# EAGLE design cdrbot (EAGLE 6.2)
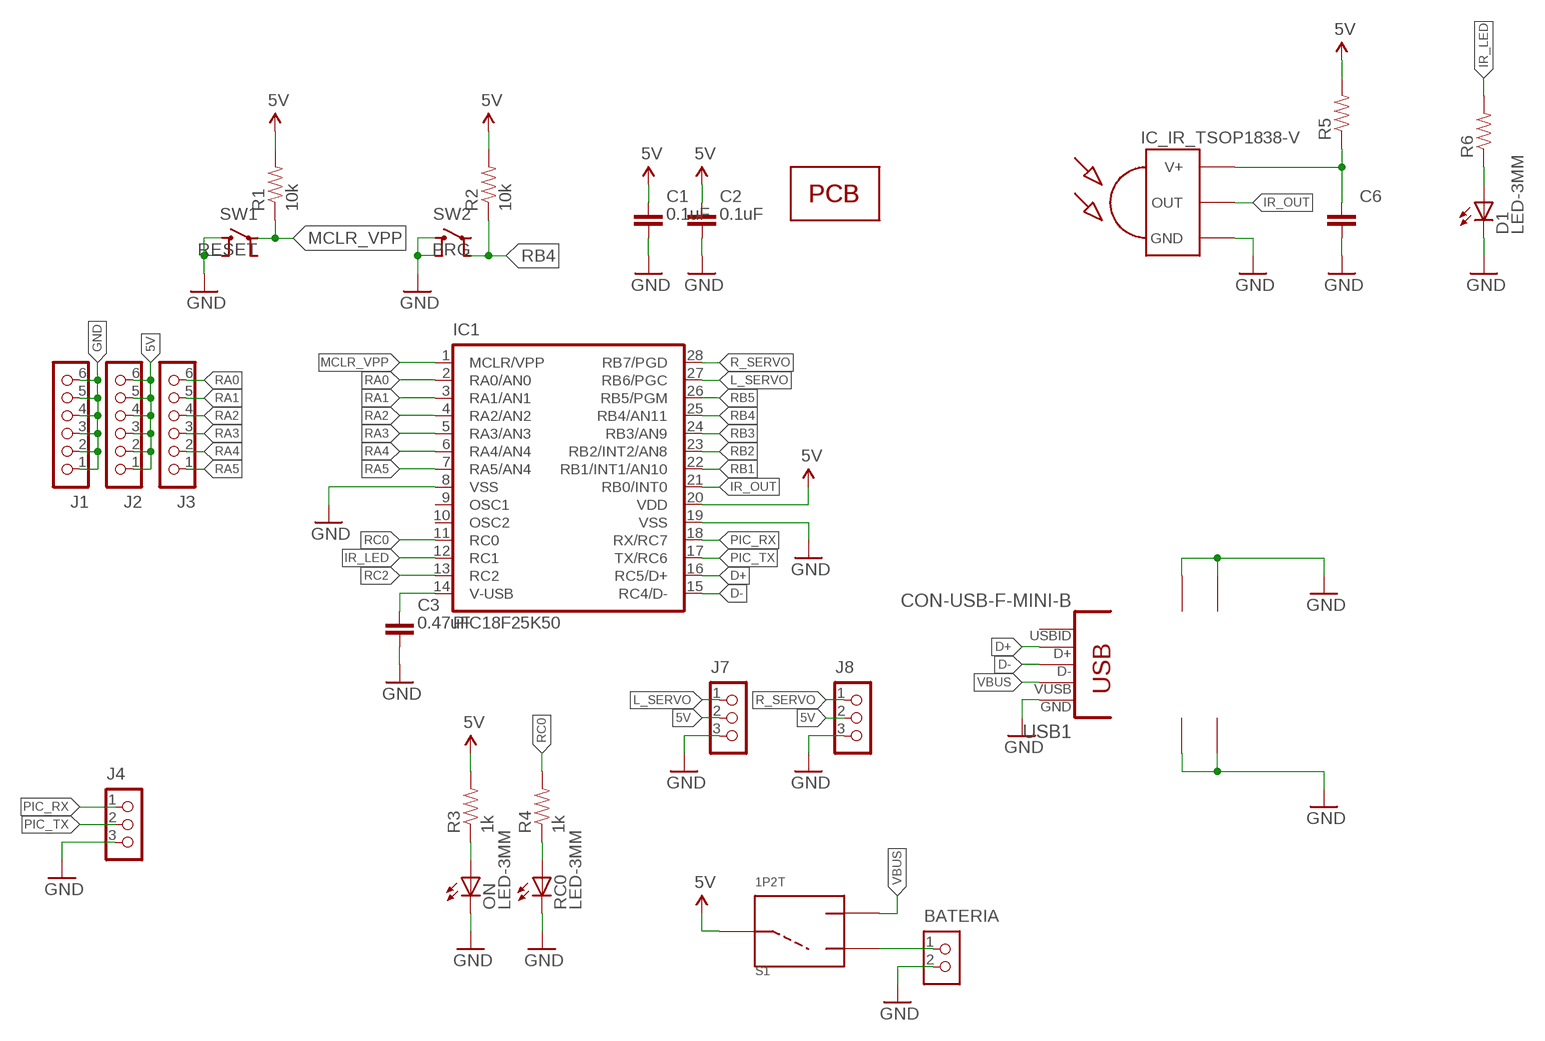
[diagram p0: schematic, sheet 1]

## Parts
BATERIA  CON_HEADER_1X02-PTH-M  [M1X02_M]
C1  0.1uF  CAPACITOR-DECOUPLING  [C025-025X050]
C2  0.1uF  CAPACITOR-DECOUPLING  [C025-025X050]
C3  0.47uF  CAPACITOR-DECOUPLING  [C025-025X050]
C6  CAPACITOR-DECOUPLING  [C025-025X050]
D1  LED-3MM  [LED-3MM]
IC1  PIC18F25K50  PIC18F2550  [DIL-28]
IC2  IC_IR_TSOP1838-V  [TSOP18XX_V]
J1  CON_HEADER_1X06-PTH_M  [M1X06_M]
J2  CON_HEADER_1X06-PTH_M  [M1X06_M]
J3  CON_HEADER_1X06-PTH_M  [M1X06_M]
J4  CON_HEADER_1X03-PTH_M  [M1X03_M]
J7  CON_HEADER_1X03-PTH_M  [M1X03_M]
J8  CON_HEADER_1X03-PTH_M  [M1X03_M]
ON  LED-3MM  [LED-3MM]
PCB1  PCB_DP_SQUARE-5X5  [PCB5X5]
R1  10k  RESISTOR-1/4W-0.3"  [RTH025W_03]
R2  10k  RESISTOR-1/4W-0.3"  [RTH025W_03]
R3  1k  RESISTOR-1/4W-0.3"  [RTH025W_03]
R4  1k  RESISTOR-1/4W-0.3"  [RTH025W_03]
R5  RESISTOR-1/4W-0.3"  [RTH025W_03]
R6  RESISTOR-1/4W-0.3"  [RTH025W_03]
RC0  LED-3MM  [LED-3MM]
S1  1P2T  [1P2T]
SW1  RESET  SWITCH-MOMPTH  [TACTILE-PTH]
SW2  PRG  SWITCH-MOMPTH  [TACTILE-PTH]
USB1  CON-USB-F-MINI-B  [CONN_USB_MINI-B]

## Nets
5V: C1.1 C2.1 IC1.20(VDD) J2.1 J2.2 J2.3 J2.4 J2.5 J2.6 J7.2 J8.2 R1.2 R2.2 R3.2 R5.2 S1.P$1
D+: IC1.16(RC5/D+) USB1.D+
D-: IC1.15(RC4/D-) USB1.D-
GND: BATERIA.2 C1.2 C2.2 C3.2 C6.2 D1.K(C) IC1.8(VSS) IC1.19(VSS) IC2.GND J1.1 J1.2 J1.3 J1.4 J1.5 J1.6 J4.3 J7.3 J8.3 ON.K(C) RC0.K(C) SW1.3 SW1.4 SW2.3 SW2.4 USB1.BODY@1(BODY) USB1.BODY@2(BODY) USB1.BODY@3(BODY) USB1.BODY@4(BODY) USB1.GND
IR_LED: IC1.12(RC1) R6.2
IR_OUT: IC1.21(RB0/INT0) IC2.OUT
IRLED: D1.A R6.1
L_SERVO: IC1.27(RB6/PGC) J7.1
LED1: ON.A R3.1
LED2: R4.1 RC0.A
MCLR_VPP: IC1.1(MCLR/VPP) R1.1 SW1.1
N$1: BATERIA.1 S1.P$2
PIC_RX: IC1.18(RX/RC7) J4.1
PIC_TX: IC1.17(TX/RC6) J4.2
R_SERVO: IC1.28(RB7/PGD) J8.1
RA0: IC1.2(RA0/AN0) J3.6
RA1: IC1.3(RA1/AN1) J3.5
RA2: IC1.4(RA2/AN2) J3.4
RA3: IC1.5(RA3/AN3) J3.3
RA4: IC1.6(RA4/AN4) J3.2
RA5: IC1.7(RA5/AN4) J3.1
RB1: IC1.22(RB1/INT1/AN10)
RB2: IC1.23(RB2/INT2/AN8)
RB3: IC1.24(RB3/AN9)
RB4: IC1.25(RB4/AN11) R2.1 SW2.2
RB5: IC1.26(RB5/PGM)
RC0: IC1.11(RC0) R4.2
RC2: IC1.13(RC2)
VBUS: S1.P$3 USB1.VUSB
VCC_TSOP: C6.1 IC2.VCC(V+) R5.1
VUSB: C3.1 IC1.14(V-USB)
Unconnected: IC1.9(OSC1) IC1.10(OSC2) SW1.2 SW2.1 USB1.ID(USBID)

## Library data of the parts
BATERIA = gary:CON_HEADER_1X02
C1-C3 C6 = gary:CAPACITOR: Non-Polarized capacitor in various packages
D1 ON RC0 = gary:LED: Light Emitting Diode
IC1 = gary:PIC18F2550
IC2 = gary:IC_IR_TSOP1838: IR Receiver and Demodulator
J1-J3 = gary:CON_HEADER_1X06
J4 J7 J8 = gary:CON_HEADER_1X03
PCB1 = gary:PCB_DP_SQUARE: Dangerous Prototypes Standard Square PCB sizes
R1-R6 = gary:RESISTOR: Resistor Basic schematic elements and footprints for 0603, 1206, and PTH resistors.
S1 = gary:1P2T: BAS012
SW1 SW2 = gary:SWITCH-MOM
USB1 = dp_devices:CON-USB-F: USB Female connector

## Board
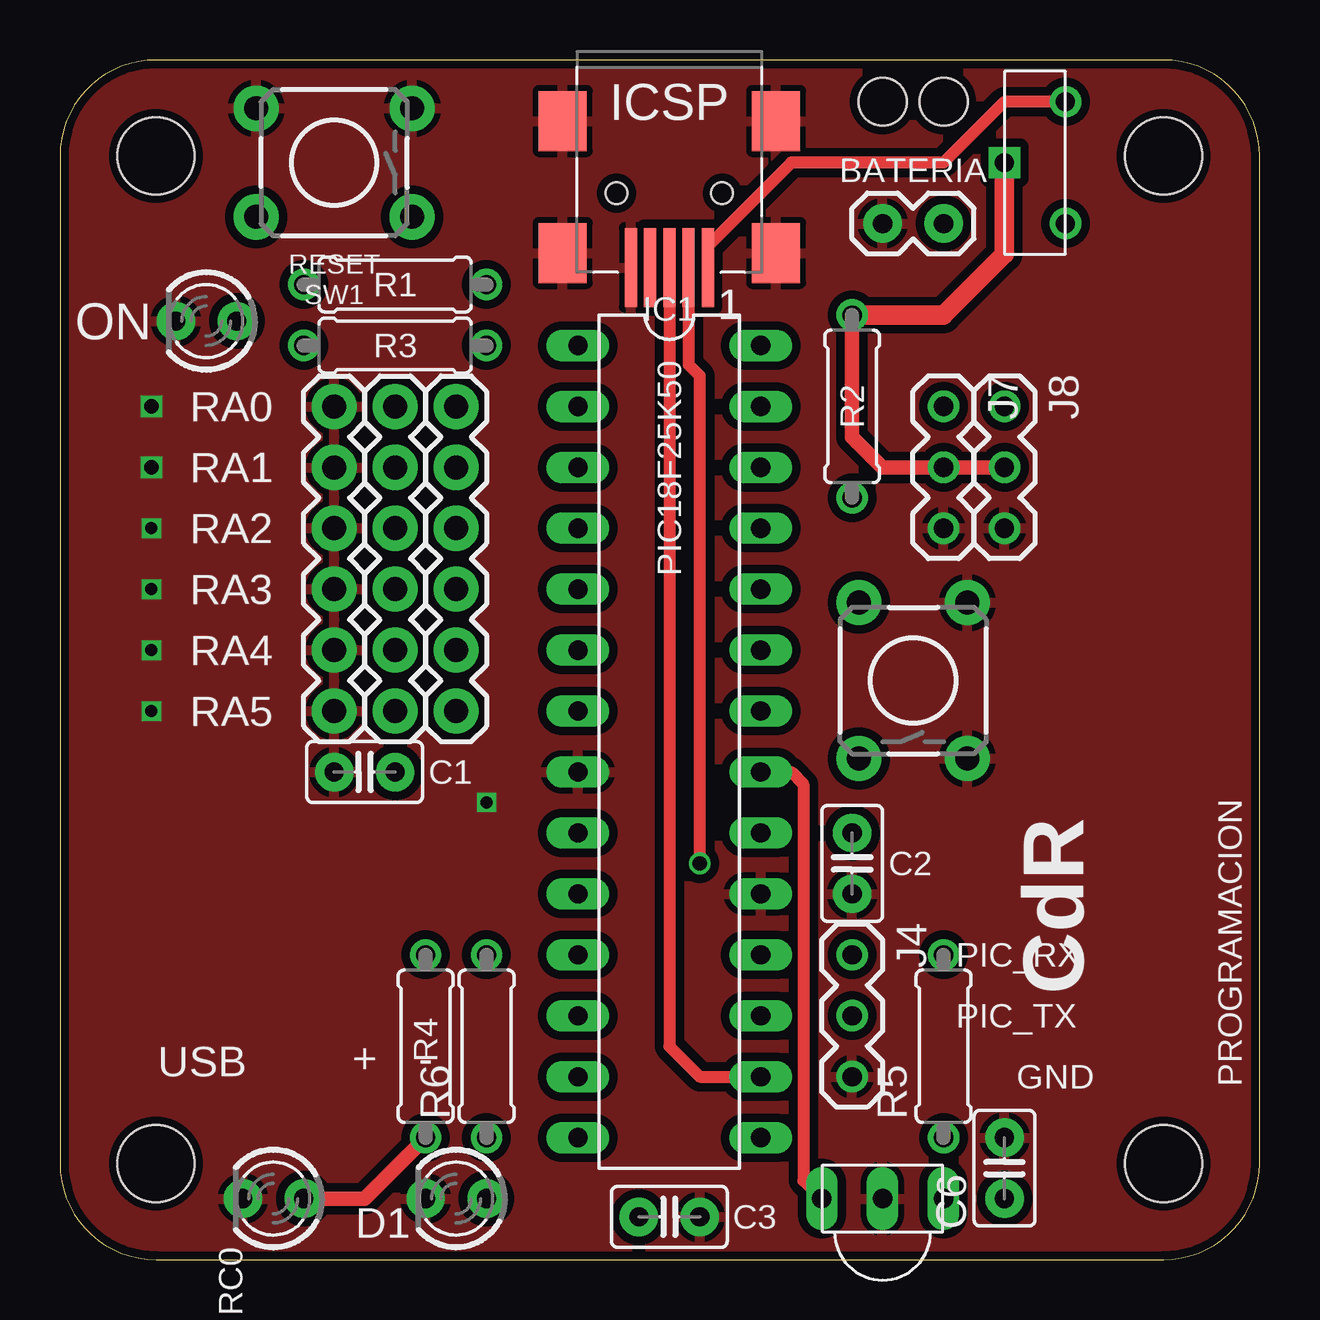
[diagram p1: board, top side]
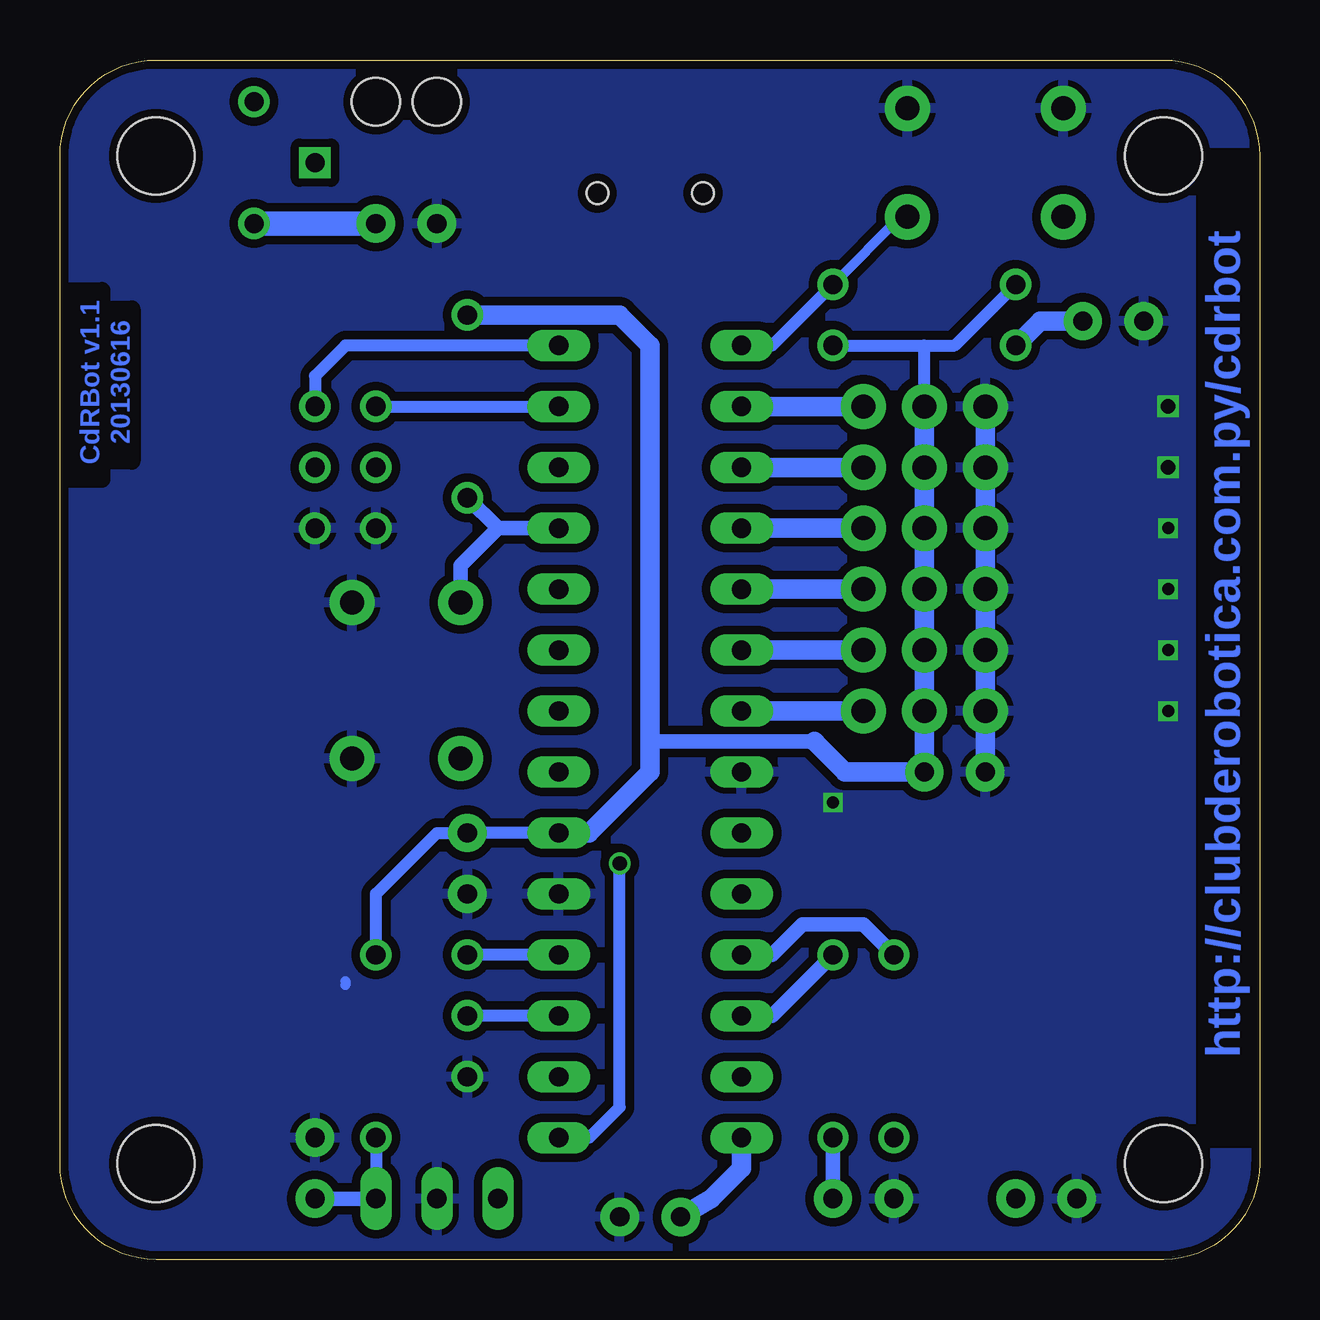
[diagram p2: board, bottom side, seen from below]

Size 50 x 50 mm. Coordinates in mm from the lower left corner, seen from the top.
Copper layers (1*16): Top 0.035mm / dielectric 1.5mm / Bottom 0.035mm
Design rules: minimum track width 6mil, minimum drill 12mil, track to track 6mil, track to pad 6mil, pad to pad 6mil, via to via 6mil, smd to smd 0mil, copper to edge 10mil, drill to drill 10mil, minimum pad ring 10mil, minimum via ring 6mil, stop-mask expansion 2mil, vias tented up to drill 100mil, thermal gap 10mil
Holes 2 mm at 34.29,48.26 36.83,48.26
bRestrict: area 0,5 to 2.3,46; area 48.3,32.5 to 50,40.4; area 47,33.3 to 48.3,39.6

### Footprints (pad centres in the part's own frame; a part is rotated, then mirrored left to right if it is on the bottom)
M1X02_M = drill 0.8 pad 1.6: 1 -1.27,0; 2 1.27,0
C025-025X050 = drill 0.8 pad 1.6: 1 -1.27,0; 2 1.27,0
LED-3MM = drill 0.8 pad 1.6: A -1.27,0; K 1.27,0
DIL-28 = drill 0.8 long: 1 -16.51,-3.81; 2 -13.97,-3.81; 3 -11.43,-3.81; 4 -8.89,-3.81; 5 -6.35,-3.81; 6 -3.81,-3.81; 7 -1.27,-3.81; 8 1.27,-3.81; 9 3.81,-3.81; 10 6.35,-3.81; 11 8.89,-3.81; 12 11.43,-3.81; 13 13.97,-3.81; 14 16.51,-3.81; 15 16.51,3.81; 16 13.97,3.81; 17 11.43,3.81; 18 8.89,3.81; 19 6.35,3.81; 20 3.81,3.81; 21 1.27,3.81; 22 -1.27,3.81; 23 -3.81,3.81; 24 -6.35,3.81; 25 -8.89,3.81; 26 -11.43,3.81; 27 -13.97,3.81; 28 -16.51,3.81
TSOP18XX_V = drill 0.8 long: GND 0,0; OUT -2.54,0; VCC 2.54,0
M1X06_M = drill 1 pad 1.88: 1 0,0; 2 2.54,0; 3 5.08,0; 4 7.62,0; 5 10.16,0; 6 12.7,0
M1X03_M = drill 0.8: 1 0,0; 2 2.54,0; 3 5.08,0
PCB5X5 = hole 3.2: 4,4; 46,4; 46,46; 4,46
RTH025W_03 = drill 0.8: 1 -3.81,0; 2 3.81,0
1P2T = drill 0.8 square: P$1 0,0 | drill 0.8: P$2 -2.54,-2.54; P$3 2.54,-2.54
TACTILE-PTH = drill 1 pad 1.88: 1 -3.251,2.261; 2 3.251,2.261; 3 -3.251,-2.261; 4 3.251,-2.261
CONN_USB_MINI-B = smd 2 x 2.5: BODY@1 -4.45,2.5; BODY@2 4.45,2.5; BODY@3 4.45,-3; BODY@4 -4.45,-3 | smd 0.5 x 3.3: D+ 0,3.1; D- -0.8,3.1; GND 1.6,3.1; ID 0.8,3.1; VUSB -1.6,3.1 | hole 0.9: -2.2,0; 2.2,0

### Placement (x,y rotation side)
BATERIA  35.56,43.18 180 top
C1  12.7,20.32 180 top
C2  33.02,16.51 270 top
C3  25.4,1.78 0 top
C6  39.37,3.81 90 top
D1  16.51,2.54 180 top
IC1  25.4,21.59 270 top
IC2  34.29,2.54 0 top
J1  11.43,22.86 90 top
J2  13.97,22.86 90 top
J3  16.51,22.86 90 top
J4  33.02,12.7 270 top
J7  36.83,35.56 270 top
J8  39.37,35.56 270 top
ON  6.1,39.12 180 top
PCB1  0,0 0 top
R1  13.97,40.64 180 top
R2  33.02,35.56 90 top
R3  13.97,38.1 0 top
R4  15.24,8.89 90 top
R5  36.83,8.89 90 top
R6  17.78,8.89 90 top
RC0  8.89,2.54 180 top
S1  39.37,45.72 90 top
SW1  11.43,45.72 180 top
SW2  35.56,24.13 90 top
USB1  25.4,44.45 180 top

### Tracks (layer width: path | path; a pad name or v marks a point on that pad's centre or on a via)
5V
  Top 0.61: J8.2 J7.2 34.29,33.02 33.02,34.29 R2.2
  Top 0.813: R2.2 36.83,39.37 39.37,41.91 S1.P$1
  Bottom 0.508: R3.2 13.97,38.1 | 13.97,38.1 12.7,38.1 R1.2 | IC1.20 C2.1 34.29,17.78 36.83,15.24 R5.2 | J2.6 13.97,38.1
  Bottom 0.61: 18.41,21.59 18.54,21.59 25.4,21.59
  Bottom 0.813: J2.6 J2.5 J2.4 J2.3 J2.2 J2.1 C1.1 17.27,20.32 18.54,21.59 | R2.2 26.67,39.37 25.4,38.1 25.4,21.59 25.4,20.32 27.94,17.78 IC1.20
D+
  Top 0.508: USB1.D+ 25.4,8.89 26.67,7.62 IC1.16
D-  (via drill 0.6)
  Top 0.508: v26.67,16.51 26.67,36.83 26.2,37.3 USB1.D-
  Bottom 0.508: IC1.15 27.94,5.08 26.67,6.35 v26.67,16.51
GND  (via drill 0.5, 0.6)
  Bottom 0.406: 38.1,11.61 38.1,11.43
  Bottom 0.813: J1.6 J1.5 J1.4 J1.3 J1.2 J1.1 C1.2
  other vias: 3.81,35.56 3.81,33.02 3.81,30.48 3.81,27.94 3.81,25.4 3.81,22.86 17.78,19.05
  pour Bottom (isolate 0.356): 0,0 0,50.04 50.04,50.04 50.04,0
  pour Top (isolate 0.356): 0,0 50.04,0 50.04,50.04 0,50.04
IR_LED
  Bottom 0.61: IC1.12 20.32,10.16 R6.2
IR_OUT
  Top 0.508: IC1.21 30.48,20.32 30.99,19.81 30.99,3.3 IC2.OUT
IRLED
  Bottom 0.61: R6.1 D1.A
L_SERVO
  Bottom 0.508: J7.1 IC1.27
LED1
  Bottom 0.813: ON.A 9.14,39.12 R3.1
LED2
  Top 0.61: RC0.A 12.7,2.54 R4.1
MCLR_VPP
  Bottom 0.406: SW1.1 14.96,43.46 R1.1
  Bottom 0.508: R1.1 20.32,38.1 IC1.1
N$1
  Bottom 1.016: S1.P$2 BATERIA.1
PIC_RX
  Bottom 0.508: IC1.18 J4.1
PIC_TX
  Bottom 0.508: IC1.17 J4.2
R_SERVO
  Bottom 0.508: J8.1 39.37,36.83 38.1,38.1 IC1.28
RA0
  Bottom 0.813: J3.6 IC1.2
RA1
  Bottom 0.813: IC1.3 J3.5
RA2
  Bottom 0.813: IC1.4 J3.4
RA3
  Bottom 0.813: IC1.5 J3.3
RA4
  Bottom 0.813: J3.2 IC1.6
RA5
  Bottom 0.813: IC1.7 J3.1
RB4
  Bottom 0.61: IC1.25 31.75,30.48 | 31.75,30.48 R2.1 | SW2.2 33.3,28.93 31.75,30.48
RC0
  Bottom 0.61: IC1.11 20.32,12.7 19.05,13.97 16.51,13.97 R4.2
VBUS
  Top 0.508: S1.P$3 39.37,48.26 36.83,45.72 30.48,45.72 27,42.24 USB1.VUSB
VCC_TSOP
  Bottom 0.508: R5.1 IC2.VCC
  Bottom 0.61: IC2.VCC C6.1
VUSB
  Bottom 0.813: C3.1 22.86,2.54 21.59,3.81 IC1.14

### Text on the board
Bottom: 20130616 | CdRBot v1.1 | http://clubderobotica.com.py/cdrbot
tNames: ICSP | RESET | SW1 | PRG | SW2 | RA0 | RA1 | RA2 | RA3 | RA4 | RA5 | CdR | PIC_RX | PROGRAMACION | PIC_TX | USB | + | - | GND